# Altium schematic sheet ETH-PHY.SchDoc
size A4; SheetNumber: 7; SheetTotal: 11
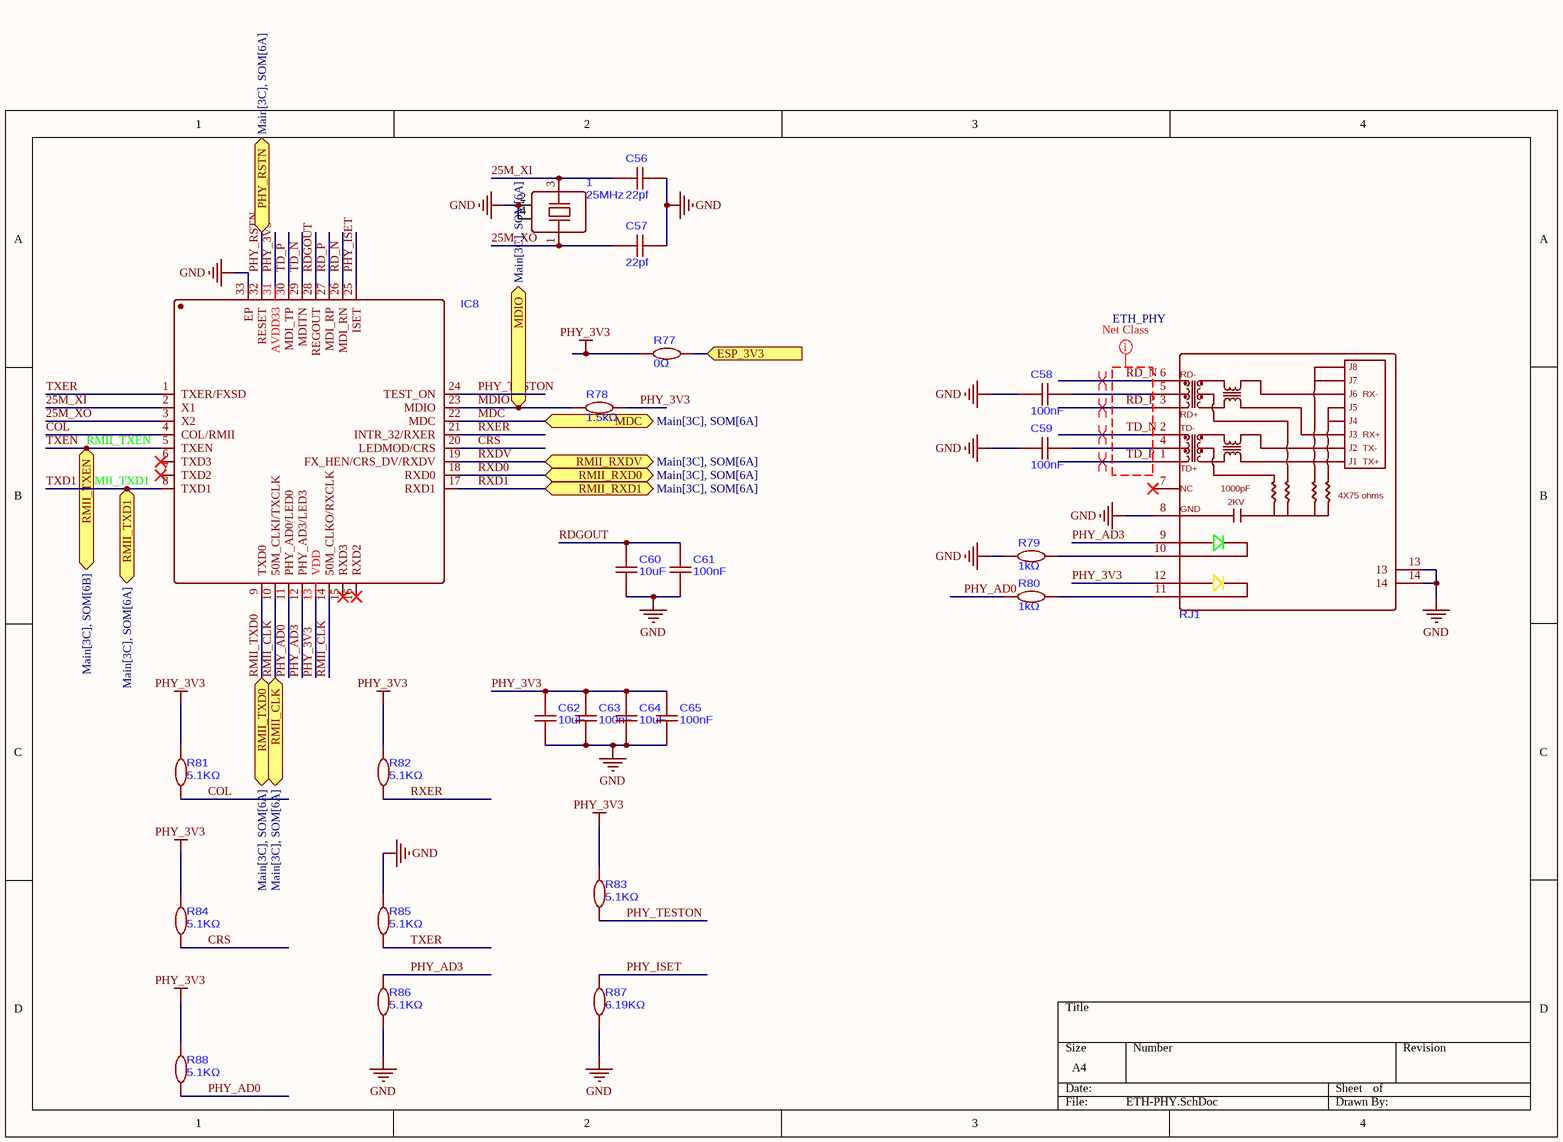
[diagram p0: ETH-PHY.SchDoc]

## Parts
1  25MHz  [CRYSTAL-SMD_4P-L3.2-W2.5-BL]
C56  22pf  [C0603]
C57  22pf  [C0603]
C58  100nF  [C0603]
C59  100nF  [C0603]
C60  10uF  [C0603]
C61  100nF  [C0603]
C62  10uF  [C0603]
C63  100nF  [C0603]
C64  10uF  [C0603]
C65  100nF  [C0603]
IC8  Single Port Fast Ethernet Transceiver  [QFN-32_L4.0-W4.0-P0.40-BL-EP2.7]  (value not drawn)
R77  0Ω  [R0603]
R78  1.5kΩ  [R0603]
R79  1kΩ  [R0603]
R80  1kΩ  [R0603]
R81  5.1KΩ  [R0603]
R82  5.1KΩ  [R0603]
R83  5.1KΩ  [R0603]
R84  5.1KΩ  [R0603]
R85  5.1KΩ  [R0603]
R86  5.1KΩ  [R0603]
R87  6.19KΩ  [R0603]
R88  5.1KΩ  [R0603]
RJ1  CONN MOD JACK RJ45 TH  [RJ45-TH_HR913550A]  (value not drawn)

## Ports
ESP_3V3 (in, see Main[4C], DSI&CSI CONNECTOR[3C], interfaceUART&I2C[1C], Power[4C], SOM[6B]), MDC (bidir, see Main[3C], SOM[6A]), MDIO (bidir, see Main[3C], SOM[6A]), PHY_RSTN (bidir, see Main[3C], SOM[6A]), RMII_CLK (bidir, see Main[3C], SOM[6A]), RMII_RXD0 (bidir, see Main[3C], SOM[6A]), RMII_RXD1 (bidir, see Main[3C], SOM[6A]), RMII_RXDV (bidir, see Main[3C], SOM[6A]), RMII_TXD0 (bidir, see Main[3C], SOM[6A]), RMII_TXD1 (bidir, see Main[3C], SOM[6A]), RMII_TXEN (bidir, see Main[3C], SOM[6B])

## Nets
GND: 1.2(GND) 1.4(GND) C56.2 C57.2 C58.1 C59.1 C60.1 C61.1 C62.1 C63.1 C64.1 C65.1 IC8.33(EP) R79.1 R85.2 R86.2 R87.1 RJ1.8(GND) RJ1.13 RJ1.14
PHY_3V3: C62.2 C63.2 C64.2 C65.2 IC8.13(VDD) IC8.31(AVDD33) R77.1 R78.2 R81.2 R82.2 R83.2 R84.2 R88.2 RJ1.12
25M_XI: 1.3(OSC2) C56.1 IC8.2(X1)
25M_XO: 1.1(OSC1) C57.1 IC8.3(X2)
COL: IC8.4(COL/RMII) R81.1
CRS: IC8.20(LEDMOD/CRS) R84.1
ESP_3V3: R77.2 ; port ESP_3V3
MDC: IC8.22(MDC) ; port MDC
MDIO: IC8.23(MDIO) R78.1 ; port MDIO
PHY_AD0: IC8.11(PHY_AD0/LED0) R80.1 R88.1
PHY_AD3: IC8.12(PHY_AD3/LED3) R86.1 RJ1.9
PHY_ISET: IC8.25(ISET) R87.2
PHY_RSTN: IC8.32(RESET) ; port PHY_RSTN
PHY_TESTON: IC8.24(TEST_ON) R83.1
RD_N: IC8.26(MDI_RN) RJ1.6
RD_P: IC8.27(MDI_RP) RJ1.3
RDGOUT: C60.2 C61.2 IC8.28(REGOUT)
RMII_CLK: IC8.10(50M_CLKI/TXCLK) IC8.14(50M_CLKO/RXCLK) ; port RMII_CLK
RMII_TXD0: IC8.9(TXD0) ; port RMII_TXD0
RMII_TXD1: IC8.8(TXD1) ; port RMII_TXD1  [also labelled TXD1]
RMII_TXEN: IC8.5(TXEN) ; port RMII_TXEN  [also labelled TXEN]
RXD0: IC8.18(RXD0) ; port RMII_RXD0
RXD1: IC8.17(RXD1) ; port RMII_RXD1
RXDV: IC8.19(FX_HEN/CRS_DV/RXDV) ; port RMII_RXDV
RXER: IC8.21(INTR_32/RXER) R82.1
TD_N: IC8.29(MDITN) RJ1.2
TD_P: IC8.30(MDI_TP) RJ1.1
TXER: IC8.1(TXER/FXSD) R85.1
NetC58_2: C58.2 RJ1.5
NetC59_2: C59.2 RJ1.4
NetR79_2: R79.2 RJ1.10
NetR80_2: R80.2 RJ1.11

Not connected (* = marked no-connect by the designer): IC8 6(TXD3)* 7(TXD2)* 15(RXD3)* 16(RXD2)*; RJ1 7(NC)*

## Layout directives
net class ETH_PHY: RD_N, RD_P, TD_N, TD_P
differential pair; net class DIFF100; differential pair class DIFF100: RD_N, RD_P, TD_N, TD_P

## Notes on the sheet
- (in symbol HR913550A) J8; RD-; J7; J6; RX-; J5; RD+; J4; TD-; J3; RX+; J2; TX-; J1; TX+; TD+; 1000pF; 4X75 ohms; 2KV

## Library data of the parts
1 = X322525MOB4SI
C56 C57 = CL10C220JB8NNNC: 50V 22pF C0G ±5% 0603 Ceramic Capacitors RoHS
C58 C59 C61 C63 C65 = CC0603KRX7R9BB104: 50V 100nF X7R ±10% 0603 Ceramic Capacitors ROHS
C60 C62 C64 = CL10A106MA8NRNC: 25V 10uF X5R ±20% 0603 Ceramic Capacitors ROHS
IC8 = IP101GRI: Ethernet Transceiver 3.3V QFN-32-EP(4x4) Drivers, Receivers, Transceivers RoHS
R77 = RC0603JR-070RL: 100mW 0Ω 75V Thick Film Resistor ±5% 0603 Chip Resistor - Surface Mount RoHS
R78 = RC0603FR-071K5L: 100mW 1.5kΩ 75V ±100ppm/℃ Thick Film Resistor ±1% 0603 Chip Resistor - Surface Mount RoHS
R79 R80 = RMC 0603 1K J N: 100mW 1kΩ 50V ±100ppm/℃ Thick Film Resistor ±5% 0603 Chip Resistor - Surface Mount ROHS
R81-R86 R88 = FRC0603F5101TS: 100mW 5.1kΩ 75V ±100ppm/℃ Thick Film Resistor ±1% 0603 Chip Resistor - Surface Mount RoHS
R87 = AC0603FR-076K19L: 6.19kΩ 100mW 75V ±100ppm/℃ Thick Film Resistor ±1% 0603 Chip Resistor - Surface Mount RoHS
RJ1 = HR913550A: 1 With LED Through Hole Modular/Ethernet Connector Jacks With Magnetics RoHS